# EAGLE schematic R2P_PS_v1 (EAGLE 6.2)
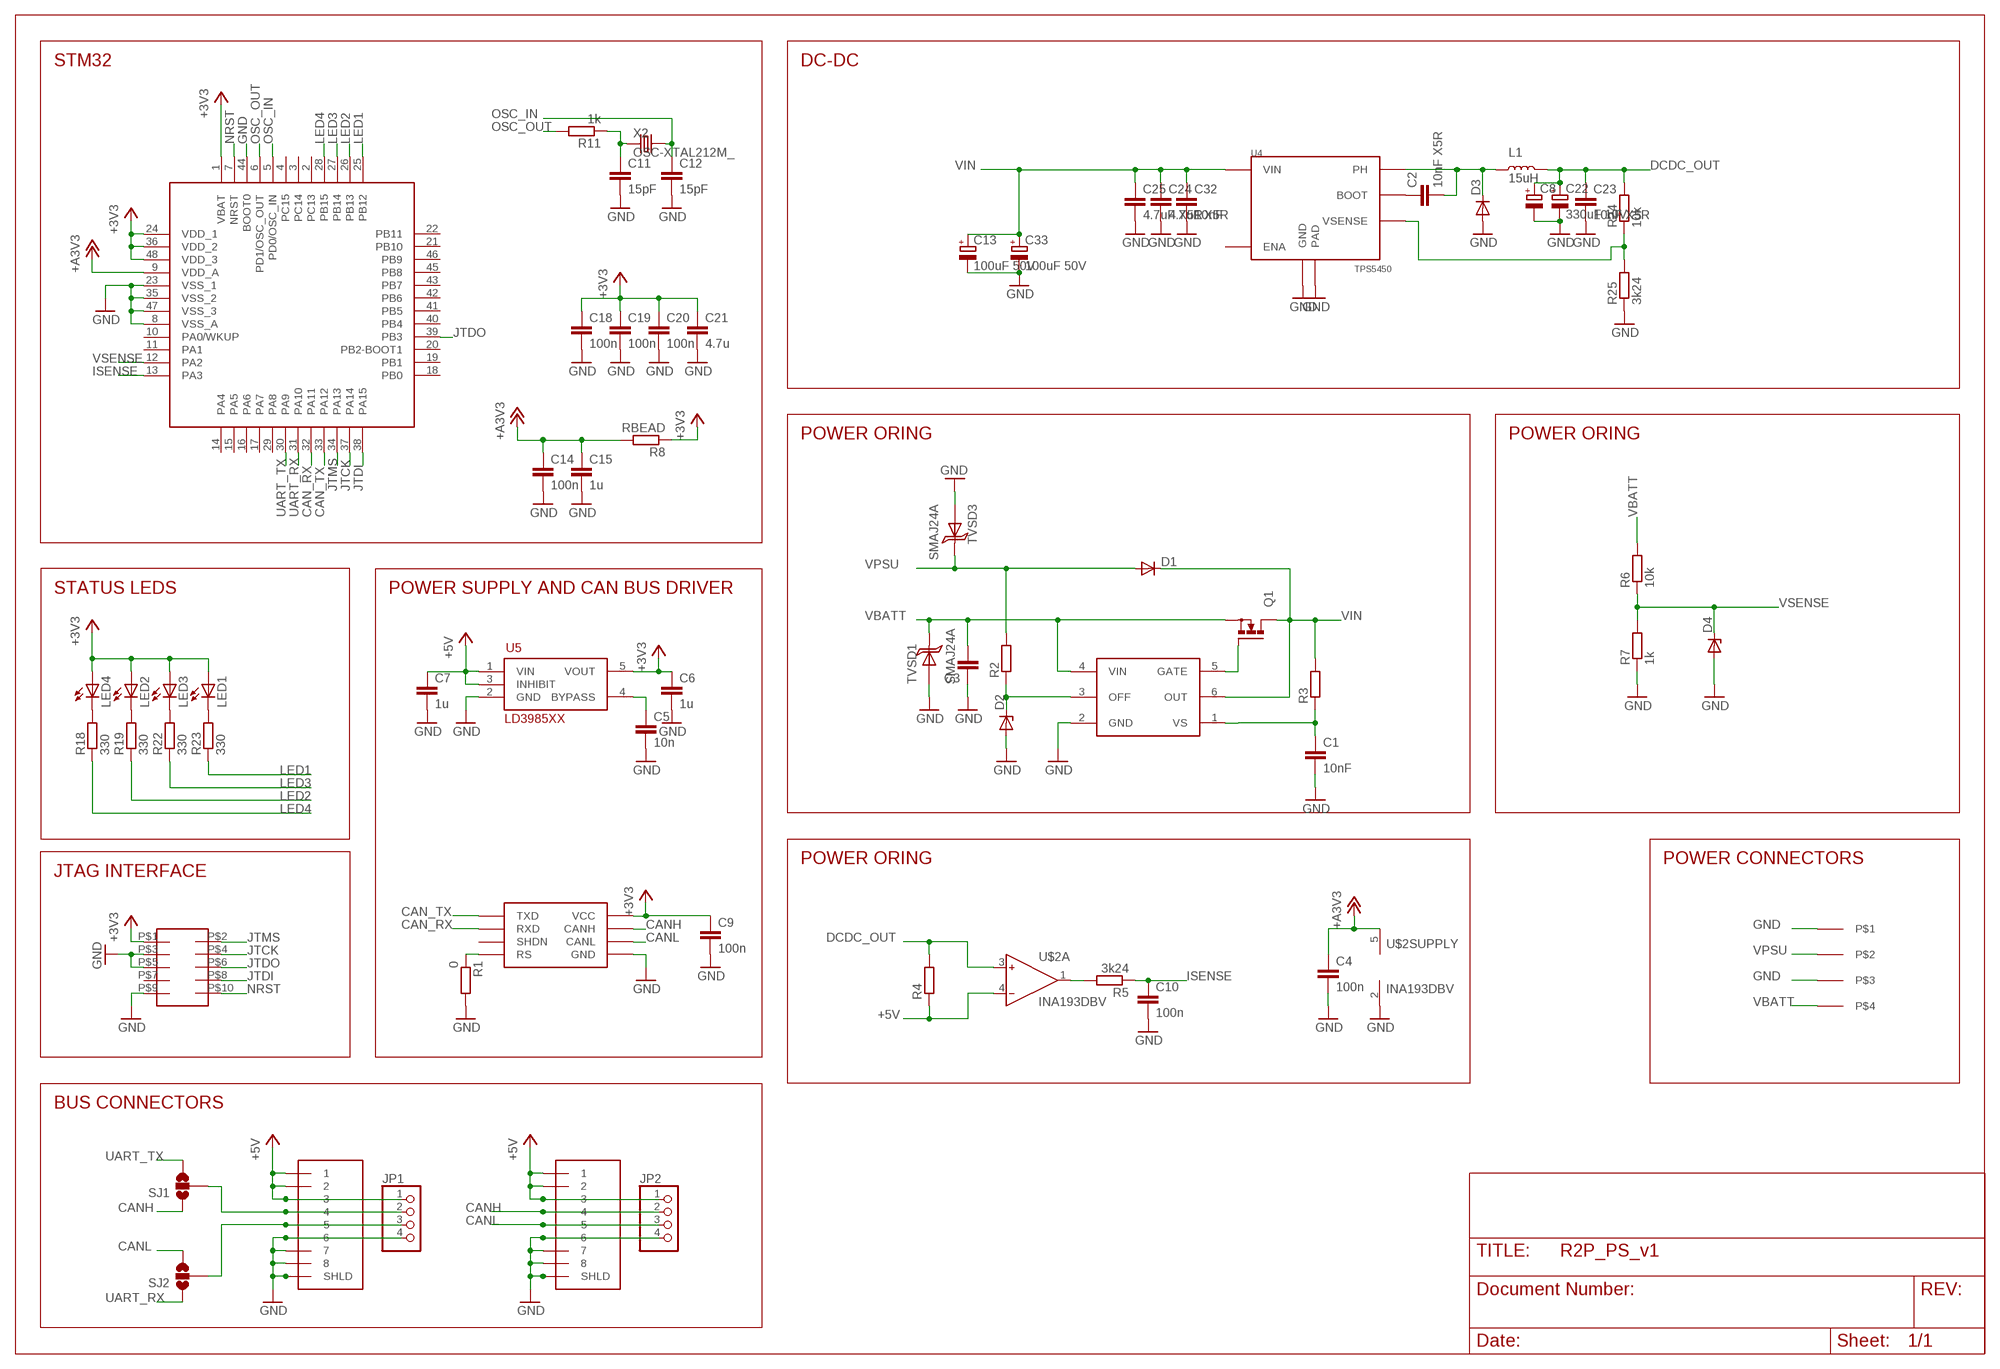
[diagram p0: schematic, sheet 1]

## Parts
1  RJ45-43860  [0438600010]
2  RJ45-43860  [0438600010]
C1  10nF  C-EUC0603  [C0603]
C2  10nF X5R  C-EUC0603  [C0603]
C3  C-EUC0805  [C0805]
C4  100n  C-EUC0603  [C0603]
C5  10n  C-EUC0603  [C0603]
C6  1u  C-EUC0603  [C0603]
C7  1u  C-EUC0603  [C0603]
C8  CPOL-EUE5-10.5  [E5-10,5]
C9  100n  C-EUC0603  [C0603]
C10  100n  C-EUC0603  [C0603]
C11  15pF  C-EUC0603  [C0603]
C12  15pF  C-EUC0603  [C0603]
C13  100uF 50V  CPOL-EUE5-10.5  [E5-10,5]
C14  100n  C-EUC0603  [C0603]
C15  1u  C-EUC0603  [C0603]
C18  100n  C-EUC0603  [C0603]
C19  100n  C-EUC0603  [C0603]
C20  100n  C-EUC0603  [C0603]
C21  4.7u  C-EUC0805  [C0805]
C22  330uF 10V  CPOL-EUE2.5-7  [E2,5-7]
C23  10nF X5R  C-EUC0603  [C0603]
C24  4.7uF X5R  C-EUC1210  [C1210]
C25  4.7uF X5R  C-EUC1210  [C1210]
C32  10nF  C-EUC0603  [C0603]
C33  100uF 50V  CPOL-EUE2.5-7  [E2,5-7]
D1  DIODE-DO-214AC  [DO-214AC]
D2  ZENERSOD-323F  [SOD-323F]
D3  DIODE-DO-214AC  [DO-214AC]
D4  ZENERSOD-323F  [SOD-323F]
JP1  PINHD-1X4/90  [1X04/90]
JP2  PINHD-1X4/90  [1X04/90]
L1  15uH  CDRH127  [CDRH127]
LED1  LEDCHIPLED_0805  [CHIPLED_0805]
LED2  LEDCHIPLED_0805  [CHIPLED_0805]
LED3  LEDCHIPLED_0805  [CHIPLED_0805]
LED4  LEDCHIPLED_0805  [CHIPLED_0805]
Q1  N-MOSFET-SO8S  [SO-08]
R1  0  R-EU_R0603  [R0603]
R2  R-EU_R0603  [R0603]
R3  R-EU_R0603  [R0603]
R4  R-EU_R2512  [R2512]
R5  3k24  R-EU_R0603  [R0603]
R6  10k  R-EU_R0603  [R0603]
R7  1k  R-EU_R0603  [R0603]
R8  RBEAD  R-EU_R0603  [R0603]
R11  1k  R-EU_R0603  [R0603]
R18  330  R-EU_R0603  [R0603]
R19  330  R-EU_R0603  [R0603]
R22  330  R-EU_R0603  [R0603]
R23  330  R-EU_R0603  [R0603]
R24  10k  R-EU_R0603  [R0603]
R25  3k24  R-EU_R0603  [R0603]
SJ1  SOLDERJUMPER_2WAYPASTE1&2  [SJ_3_PASTE1&2]
SJ2  SOLDERJUMPER_2WAYPASTE1&2  [SJ_3_PASTE1&2]
SOT1  MAX3051  [SOT23-8L]
TVSD1  SMAJ24A  TVSDSMA  [SMA]
TVSD3  SMAJ24A  TVSDSMA  [SMA]
U1  STM32F103CX  [LQFP48]
U4  TPS5450  [POWERPAD-SO8]
U5  LD3985XX  [SOT23-5L]
U$1  LM5050-1  [SOT23-6L]
U$2  INA193DBV  [SOT23-5L]
U$3  POWERCONN-4  [POWERCONN-4]
U$4  FTSH-105  [FTSH-105]
X2  OSC-XTAL212M_  [4X6]

## Nets
+3V3: C6.1 C9.1 C18.1 C19.1 C20.1 C21.1 LED1.A LED2.A LED3.A LED4.A R8.1 SOT1.P$3(VCC) U1.1(VBAT) U1.24(VDD_1) U1.36(VDD_2) U1.48(VDD_3) U5.5(VOUT) U$4.P$1
+5V: 1.P$1 1.P$2 1.P$3 2.P$1 2.P$2 2.P$3 C7.1 JP1.1 JP2.1 R4.1 U5.1(VIN) U5.3(INHIBIT) U$2.4(A:IN-)
+A3V3: C4.1 C14.1 C15.1 R8.2 U1.9(VDD_A) U$2.5(SUPPLY:V+)
CAN_RX: SOT1.P$4(RXD) U1.32(PA11)
CAN_TX: SOT1.P$1(TXD) U1.33(PA12)
CANH: 2.P$4 JP2.2 SJ1.1 SOT1.P$7(CANH)
CANL: 2.P$5 JP2.3 SJ2.3 SOT1.P$6(CANL)
DCDC_OUT: C8.+ C22.+ C23.1 L1.P$2 R4.2 R24.2 U$2.3(A:IN+)
GND: 1.P$6 1.P$7 1.P$8 1.P$9(SHLD) 1.P$10 2.P$6 2.P$7 2.P$8 2.P$9(SHLD) 2.P$10 C1.2 C3.1 C4.2 C5.2 C6.2 C7.2 C8.- C9.2 C10.2 C11.2 C12.2 C13.- C14.2 C15.2 C18.2 C19.2 C20.2 C21.2 C22.- C23.2 C24.2 C25.2 C32.2 C33.- D2.A D3.A D4.A JP1.4 JP2.4 R1.2 R7.1 R25.1 SOT1.P$2(GND) TVSD1.A TVSD3.A U1.8(VSS_A) U1.23(VSS_1) U1.35(VSS_2) U1.44(BOOT0) U1.47(VSS_3) U4.P6(GND) U4.PAD U5.2(GND) U$1.2(GND) U$2.2(SUPPLY:V-) U$3.P$1 U$3.P$3 U$4.P$3 U$4.P$5 U$4.P$9
ISENSE: C10.1 R5.1 U1.13(PA3)
JTCK: U1.37(PA14) U$4.P$4
JTDI: U1.38(PA15) U$4.P$8
JTDO: U1.39(PB3) U$4.P$6
JTMS: U1.34(PA13) U$4.P$2
LED1: R23.1 U1.25(PB12)
LED2: R19.1 U1.26(PB13)
LED3: R22.1 U1.27(PB14)
LED4: R18.1 U1.28(PB15)
N$2: R1.1 SOT1.P$8(RS)
N$3: 1.P$4 JP1.2 SJ1.2
N$4: C5.1 U5.4(BYPASS)
N$6: D2.C R2.1 U$1.3(OFF)
N$7: Q1.4(G) U$1.5(GATE)
N$8: 1.P$5 JP1.3 SJ2.2
N$9: C1.1 R3.1 U$1.1(VS)
N$12: C11.1 R11.1 X2.1(X1)
N$14: R5.2 U$2.1(A:OUT)
N$15: LED4.C R18.2
N$18: LED2.C R19.2
N$20: LED3.C R22.2
N$22: LED1.C R23.2
N$38: C2.1 U4.P1(BOOT)
N$48: R24.1 R25.2 U4.P4(VSENSE)
NRST: U1.7(NRST) U$4.P$10
OSC_IN: C12.1 U1.5(PD0/OSC_IN) X2.2(X2)
OSC_OUT: R11.2 U1.6(PD1/OSC_OUT)
PH: C2.2 D3.C L1.P$1 U4.P8(PH)
UART_RX: SJ2.1 U1.31(PA10)
UART_TX: SJ1.3 U1.30(PA9)
VBATT: C3.2 Q1.1(S) Q1.2(S) Q1.3(S) R6.2 TVSD1.C(K) U$1.4(VIN) U$3.P$4
VIN: C13.+ C24.1 C25.1 C32.1 C33.+ D1.C Q1.5(D) Q1.6(D) Q1.7(D) Q1.8(D) R3.2 U4.P7(VIN) U$1.6(OUT)
VPSU: D1.A R2.2 TVSD3.C(K) U$3.P$2
VSENSE: D4.C R6.1 R7.2 U1.12(PA2)
Unconnected: SOT1.P$5(SHDN) U1.2(PC13) U1.3(PC14) U1.4(PC15) U1.10(PA0/WKUP) U1.11(PA1) U1.14(PA4) U1.15(PA5) U1.16(PA6) U1.17(PA7) U1.18(PB0) U1.19(PB1) U1.20(PB2-BOOT1) U1.21(PB10) U1.22(PB11) U1.29(PA8) U1.40(PB4) U1.41(PB5) U1.42(PB6) U1.43(PB7) U1.45(PB8) U1.46(PB9) U4.P5(ENA) U$4.P$7

## Notes on the sheet
- STM32 | DC-DC
- POWER ORING | POWER ORING
- STATUS LEDS | POWER SUPPLY AND CAN BUS DRIVER
- POWER ORING | POWER CONNECTORS
- JTAG INTERFACE
- BUS CONNECTORS

## Library data of the parts
1 2 = molex:RJ45-43860
C1-C7 C9-C12 C14 C15 C18-C21 C23-C25 C32 = rcl:C-EU: CAPACITOR, European symbol
C8 C13 C22 C33 = rcl:CPOL-EU: POLARIZED CAPACITOR, European symbol
D1 D3 = diode:DIODE-: DIODE
D2 D4 = dp_devices:ZENER: Zener Diode SOD-323
JP1 JP2 = pinhead:PINHD-1X4: PIN HEADER
L1 = DCDC:CDRH127
LED1-LED4 = led:LED: LED OSRAM: - CHIPLED LG R971, LG N971, LY N971, LG Q971, LY Q971, LO R971, LY R971 LH N974, LH R974 LS Q976, LO Q976, LY Q976 LO Q996 - Hyper CHIPLED LW Q18S LB Q993, LB Q99A, LB R99A - SideLED LS A670, LO A670, LY A670, LG A670, LP A670 LB A673, LV A673, LT A673, LW A673 LH A674 LY A675 LS A676, LA A676, LO A676, LY A676, LW A676 LS A679, LY A679, LG A679 - Hyper Micro SIDELED® LS Y876, LA Y876, LO Y876, LY Y876 LT Y87S - SmartLED LW L88C, LW L88S LB L89C, LB L89S, LG L890 LS L89K, LO L89K, LY L89K LS L896, LA L896, LO L896, LY L896 - TOPLED LS T670, LO T670, LY T670, LG T670, LP T670 LSG T670, LSP T670, LSY T670, LOP T670, LYG T670 LG T671, LOG T671, LSG T671 LB T673, LV T673, LT T673, LW T673 LH T674 LS T676, LA T676, LO T676, LY T676, LB T676, LH T676, LSB T676, LW T676 LB T67C, LV T67C, LT T67C, LS T67K, LO T67K, LY T67K, LW E67C LS E67B, LA E67B, LO E67B, LY E67B, LB E67C, LV E67C, LT E67C LW T67C LS T679, LY T679, LG T679 LS T770, LO T770, LY T770, LG T770, LP T770 LB T773, LV T773, LT T773, LW T773 LH T774 LS E675, LA E675, LY E675, LS T675 LS T776, LA T776, LO T776, LY T776, LB T776 LHGB T686 LT T68C, LB T68C - Hyper Mini TOPLED® LB M676 - Mini TOPLED Santana® LG M470 LS M47K, LO M47K, LY M47K Source: http://www.osram.convergy.de LUXEON: - LUMILED® LXK2-PW12-R00, LXK2-PW12-S00, LXK2-PW14-U00, LXK2-PW14-V00 LXK2-PM12-R00, LXK2-PM12-S00, LXK2-PM14-U00 LXK2-PE12-Q00, LXK2-PE12-R00, LXK2-PE12-S00, LXK2-PE14-T00, LXK2-PE14-U00 LXK2-PB12-K00, LXK2-PB12-L00, LXK2-PB12-M00, LXK2-PB14-N00, LXK2-PB14-P00, LXK2-PB14-Q00 LXK2-PR12-L00, LXK2-PR12-M00, LXK2-PR14-Q00, LXK2-PR14-R00 LXK2-PD12-Q00, LXK2-PD12-R00, LXK2-PD12-S00 LXK2-PH12-R00, LXK2-PH12-S00 LXK2-PL12-P00, LXK2-PL12-Q00, LXK2-PL12-R00 Source: www.luxeon.com KINGBRIGHT: KA-3528ASYC Source: www.kingbright.com
Q1 = transistor-power:N-MOSFET-SO8: N-Channel MOSFET Example: FDS7760A; N-Channel Logic Level PowerTrench® MOSFET FDS2572; N-Channel UltraFET® Trench MOSFET Source: www.fairchildsemi.com
R1-R8 R11 R18 R19 R22-R25 = rcl:R-EU_: RESISTOR, European symbol
SJ1 SJ2 = SparkFun:SOLDERJUMPER_2WAY: Solder Jumper 2 way solder jumper
SOT1 = maxim:MAX3051
TVSD1 TVSD3 = TVSD:TVSD
U1 = st:STM32F103CX
U4 = DCDC:TPS5450
U5 = st:LD3985XX
U$1 = texas-instruments:LM5050-1
U$2 = texas-instruments:INA193: Current Shunt Monitor -16V to +80V Common-Mode Range
U$3 = misc:POWERCONN-4
U$4 = samtec:FTSH-105
X2 = dp_devices:OSC-XTAL2